# EasyEDA schematic SCH_Camera-With-Light-Relay.json
TITLE: Camera with Light switch; REV: 1.0; Date: 2024-02-16; Sheet: 1/1; Company: Danny Andersen
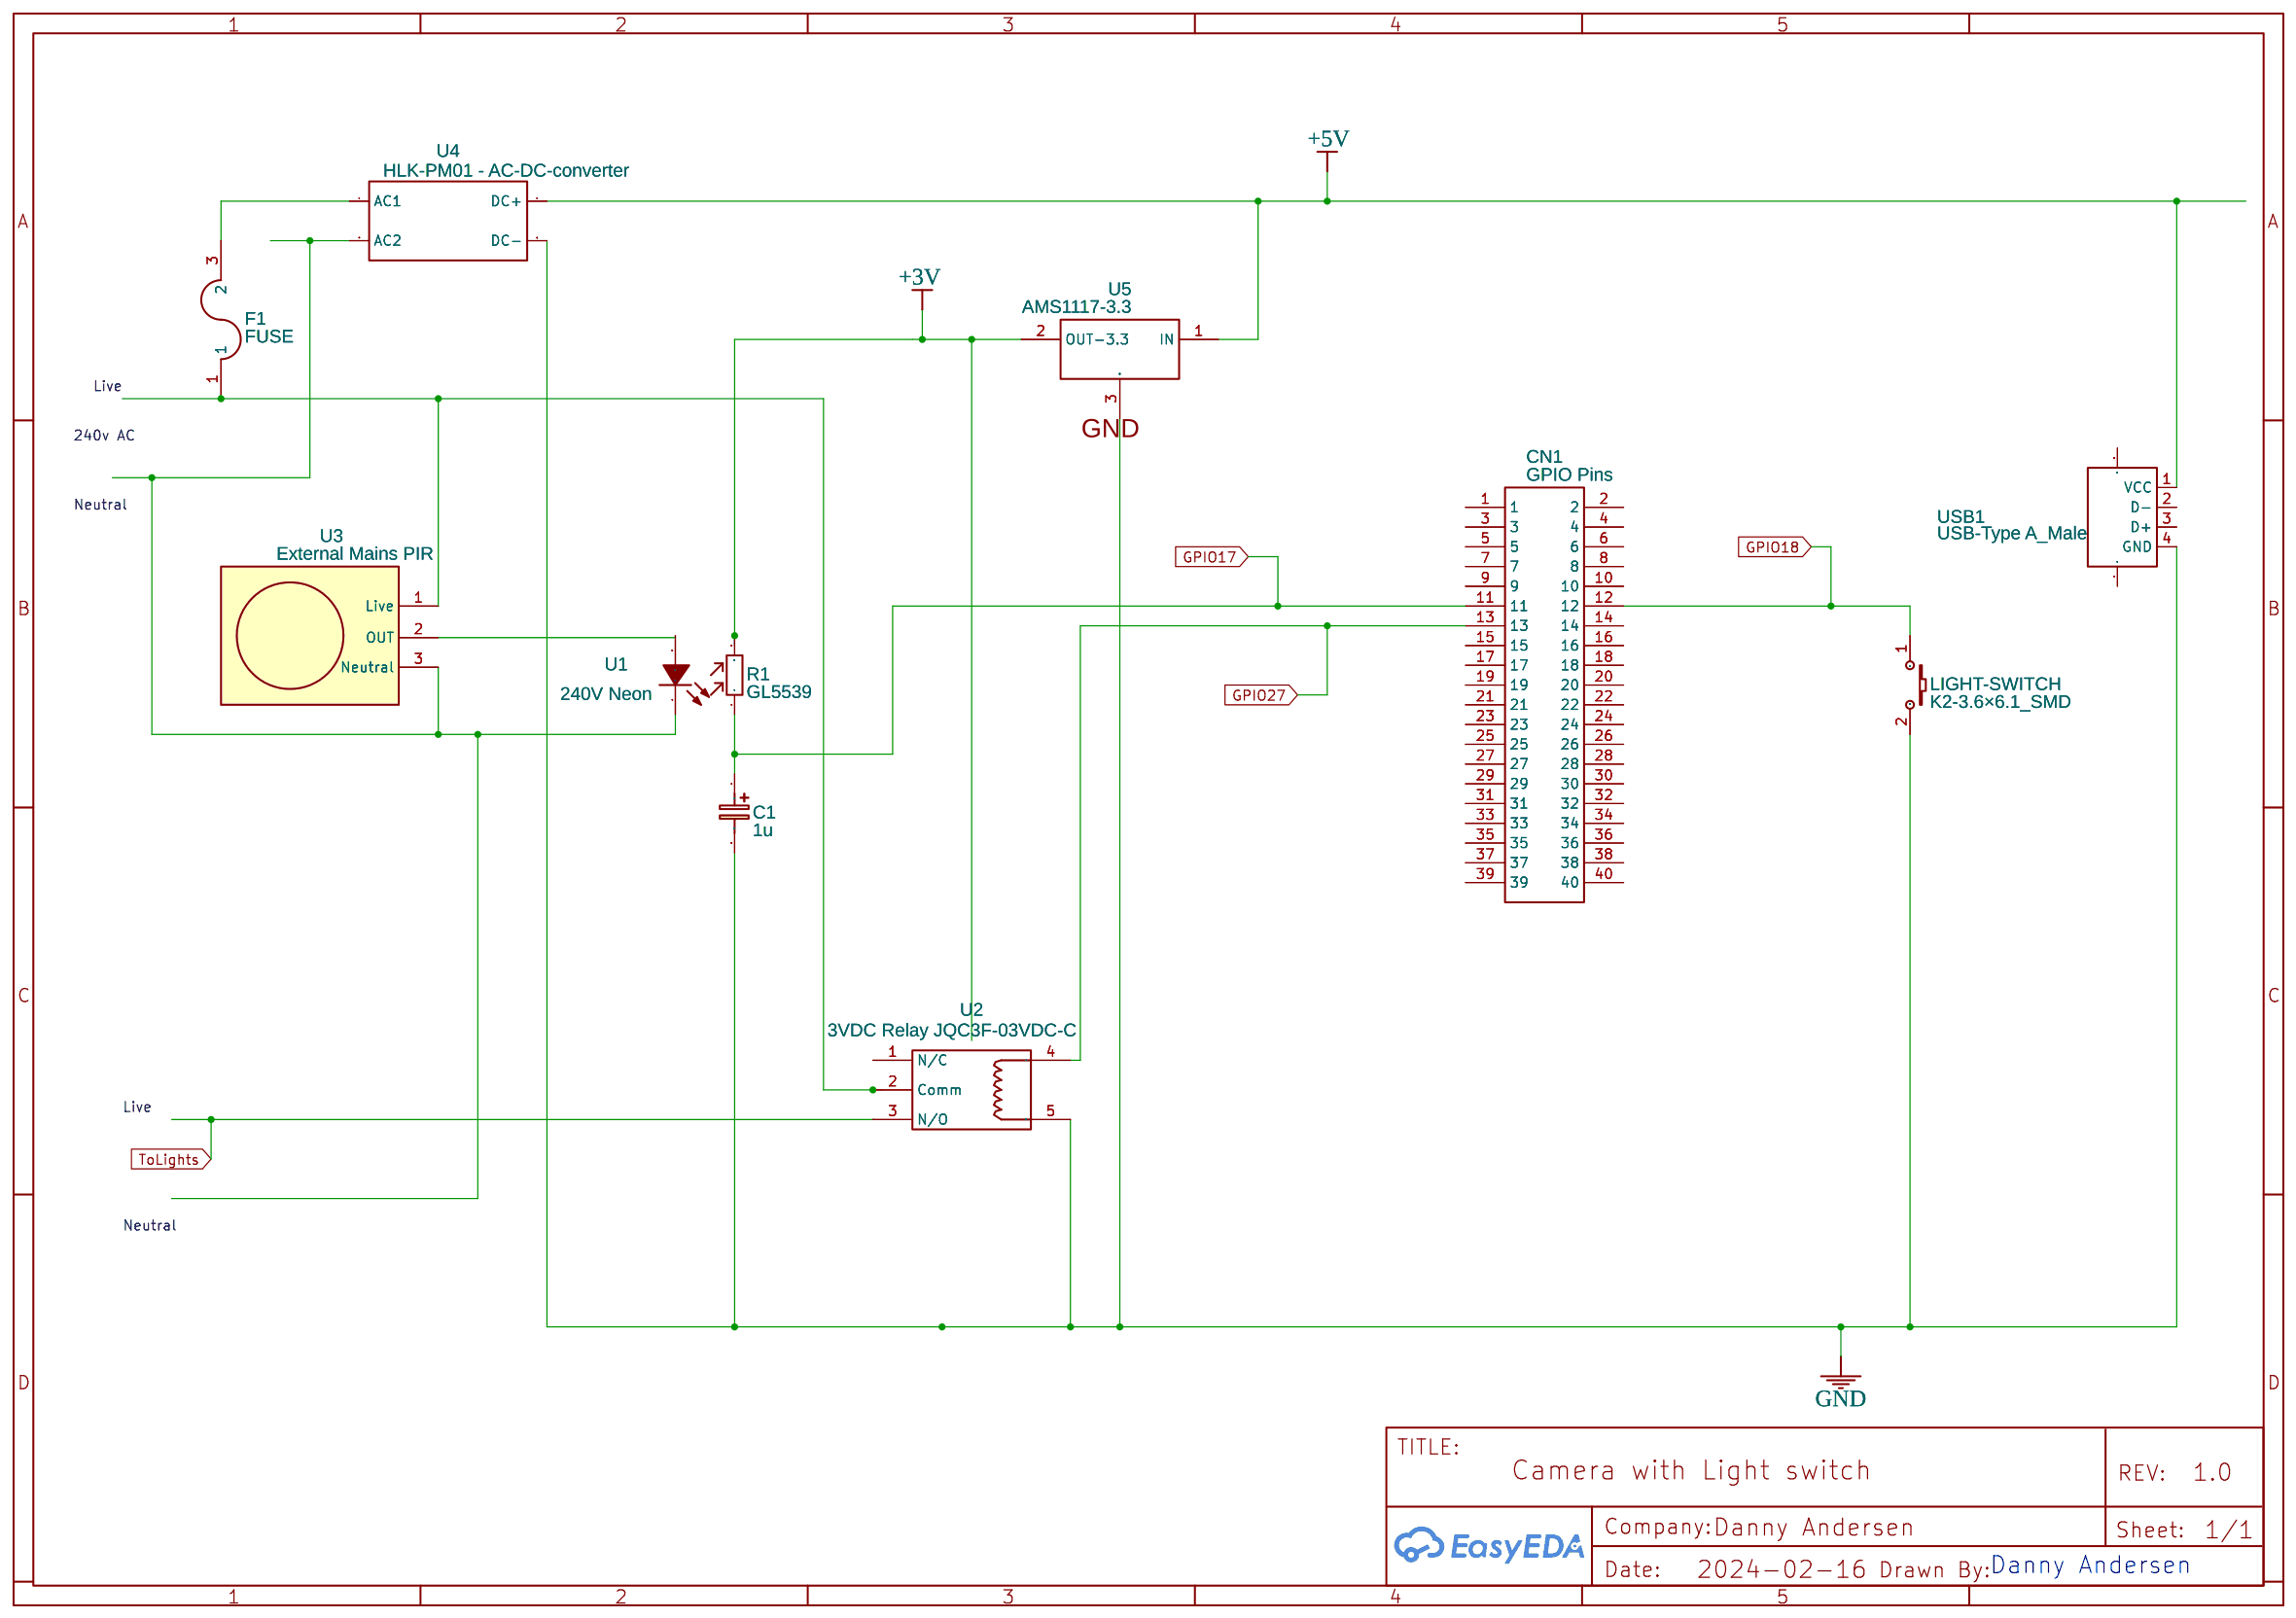
[diagram p0: schematic sheet]

## Parts
C1  1u  [CASE-A_3216]
CN1  GPIO Pins  [HDR-TH_40P-V-H-R2-P2.54]
F1  FUSE  [FUSE_5MM]
LIGHT-SWITCH  K2-3.6×6.1_SMD  [KEY-SMD_2P-L6.2-W3.6-LS8.0]
R1  GL5539  [RES-TH_L5.1-W4.3-P3.40-D0.5]
U1  240V Neon  [LED-SMD_SD65-120-LED]
U2  3VDC Relay JQC3F-03VDC-C  [JQC3F-05VDC-C]
U3  External Mains PIR
U4  HLK-PM01 - AC-DC-converter  [HLK-PM01]
U5  AMS1117-3.3  [SOT-89-3_L4.5-W2.5-P1.50-LS4.2-BR]
USB1  USB-Type A_Male  [USB-A-TH_48037-0001]

## Library data of the parts
C1 = C_Tan_SMD_A_EU: Contributor: LCEDA_Lib
CN1 = Crimping terminals2*20: Supplier: LCSC; Manufacturer: BOOMELE(博穆精密); Manufacturer Part: 2.54-2*20P压线头; Supplier Part: C21856; JLCPCB Part Class: Extended Part; link: https://lcsc.com/eda_search?q=C21856&%26type=1&ref=editor
F1 = -: catid: 20; Contributor: SparkFun; Manufacturer Part: ?
LIGHT-SWITCH = K2-3.6×6.1_SMD: Supplier Part: C118141; Supplier: LCSC; Manufacturer Part: K2-1107ST-A4SW-06; Contributor: LCEDA_Lib; 制造商: 韩国韩荣
R1 = GL5539: Supplier: LCSC; Manufacturer: 森霸; Supplier Part: C125630; JLCPCB Part Class: Extended Part
U1 = 720-LCGH9RNMXNX1: Contributor: lcsc; Supplier: LCSC; Supplier Part: C9900019959; Manufacturer: null; JLCPCB Part Class: Extended Part
U2 = 3VDC Relay JQC3F-03VDC-C: Contributor: eate.edwin.mamani.pi
U3 = -: Contributor: exersizze; sourceId: COI0iASar; Manufacturer Part: ?
U4 = -: catid: 20; sourceId: u1BzxTRca; Manufacturer Part: ?
U5 = 7805(SOT-89): Supplier: LCSC; Manufacturer: CJ; Manufacturer Part: CJ78L05; image: //image.lceda.cn/szlcsc/C2079.jpg; Supplier Part: C2079; Paste Type: expand; Contributor: LCEDA_Lib
USB1 = USB-Type A_Male: Supplier Part: C112454; Supplier: LCSC; Manufacturer: SOFNG; Manufacturer Part: USB-05; Contributor: LCEDA_Lib

## Nets
+3V: R1.2 U5.2(OUT-3.3)
+5V: U4.4(DC+) U5.1(IN) USB1.1(VCC)
GND: C1.2 LIGHT-SWITCH.2 U2.5 U4.3(DC-) U5.3(GND) USB1.4(GND)
GPIO17: C1.1 CN1.11 R1.1
GPIO18: CN1.12 LIGHT-SWITCH.1
GPIO27: CN1.13 U2.4
ToLights: U2.3(N/O)
Net-(F1-1): F1.1 U2.2(Comm) U3.1(Live)
Net-(F1-3): F1.3(2) U4.1(AC1)
Net-(U1-1): U1.1(K) U3.3(Neutral) U4.2(AC2)
Net-(U1-2): U1.2(A) U3.2(OUT)

Not connected (* = marked no-connect by the designer): CN1 1 2 3 4 5 6 7 8 9 10 14 15 16 17 18 19 20 21 22 23 24 25 26 27 28 29 30 31 32 33 34 35 36 37 38 39 40; U2 1(N/C); USB1 2(D-) 3(D+) 5 6

## Notes on the sheet
- Danny Andersen
